# Altium schematic sheet buzzer.SchDoc
size A4; SheetNumber: 6; SheetTotal: 8
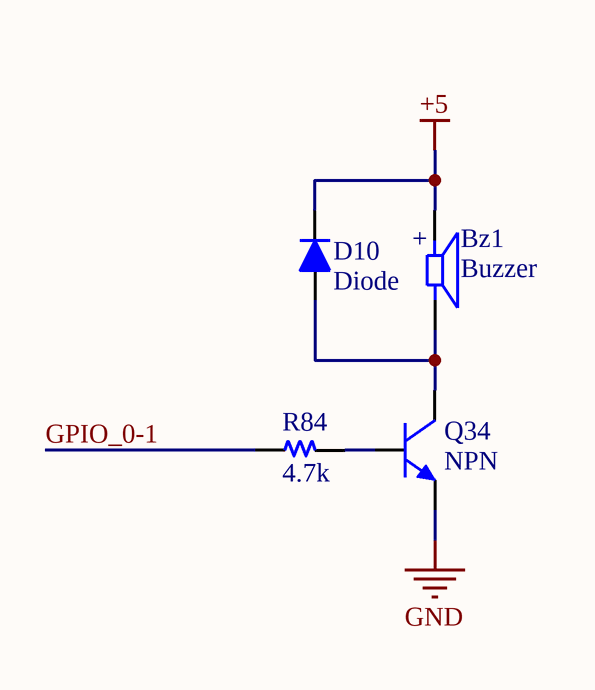
[diagram p0: buzzer.SchDoc]

## Parts
Bz1  Buzzer  [CUI_CMT-8530S-SMT]
D10  Diode  [SOD123]
Q34  NPN  [SOT-23]
R84  4.7k  [R 0603]

## Nets
+5: Bz1.P D10.2(K)
GND: Q34.2(E)
GPIO_0-1: R84.1
NetBz1_N: Bz1.N D10.1(A) Q34.3(C)
NetQ34_1: Q34.1(B) R84.2

## Notes on the sheet
- (in symbol CMT-8530S-SMT) +

## Library data of the parts
Bz1 = CMT-8530S-SMT: 8.5 mm, 3.6 Vo-p, 90 dB, Surface Mount _SMT_, Magnetic Audio Transducer Buzzer; MP: CMT-8530S-SMT-TR; MF: CUI Devices; Availability: Unavailable; SnapEDA_Link: https://www.snapeda.com/parts/CMT-8530S-SMT-TR/CUI%20Devices/view-part/649163/?ref=snap; CUI_purchase_URL: https://www.cuidevices.com/product/audio/buzzers/audio-transducers/cmt-8530s-smt-tr?utm_source=snapeda.com&utm_medium=referral&utm_campaign=snapedaBOM; Package: CUI; Price: None; Value: *
D10 = Diode: Default Diode
Q34 = Transistor NPN: NPN Bipolar Transistor
R84 = Resistor